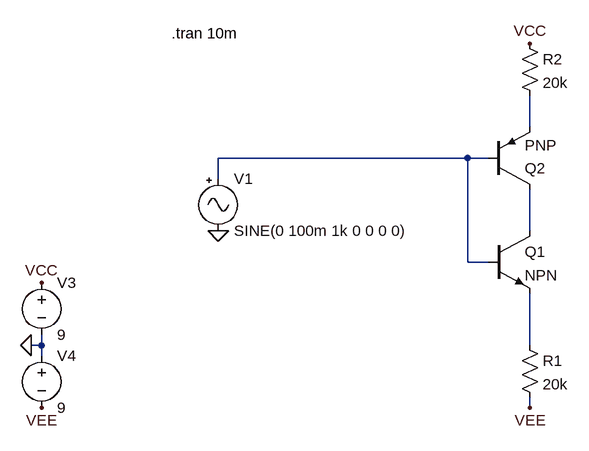
[diagram p0: schematic wavefolding.asc]
wavefolding.asc, the LTspice schematic file:
Version 4
SHEET 1 1168 716
WIRE 544 208 544 160
WIRE 448 256 64 256
WIRE 480 256 448 256
WIRE 64 288 64 256
WIRE 544 368 544 304
WIRE 448 416 448 256
WIRE 480 416 448 416
WIRE -208 544 -208 528
WIRE -208 544 -224 544
WIRE 544 544 544 464
WIRE -208 560 -208 544
WIRE 544 640 544 624
FLAG 64 368 0
FLAG -208 448 VCC
FLAG -224 544 0
FLAG -208 640 VEE
FLAG 544 640 VEE
FLAG 544 80 VCC
SYMBOL Misc/signal 64 272 R0
SYMATTR InstName V1
SYMATTR Value SINE(0 100m 1k 0 0 0 0)
SYMBOL voltage -208 432 R0
SYMATTR InstName V3
SYMATTR Value 9
SYMBOL voltage -208 544 R0
SYMATTR InstName V4
SYMATTR Value 9
SYMBOL npn 480 368 R0
SYMATTR InstName Q1
SYMBOL res 528 528 R0
SYMATTR InstName R1
SYMATTR Value 20k
SYMBOL res 528 64 R0
SYMATTR InstName R2
SYMATTR Value 20k
SYMBOL pnp 480 304 M180
SYMATTR InstName Q2
TEXT -8 64 Left 2 !.tran 10m

The netlist it stands for:
* wavefolding.asc
V1 N002 0 SINE(0 100m 1k 0 0 0 0)
V3 VCC 0 9
V4 0 VEE 9
Q1 N003 N002 N004 0 NPN
R1 N004 VEE 20k
R2 VCC N001 20k
Q2 N003 N002 N001 0 PNP
.model NPN NPN
.model PNP PNP
.lib standard.bjt
.tran 10m
.backanno
.end